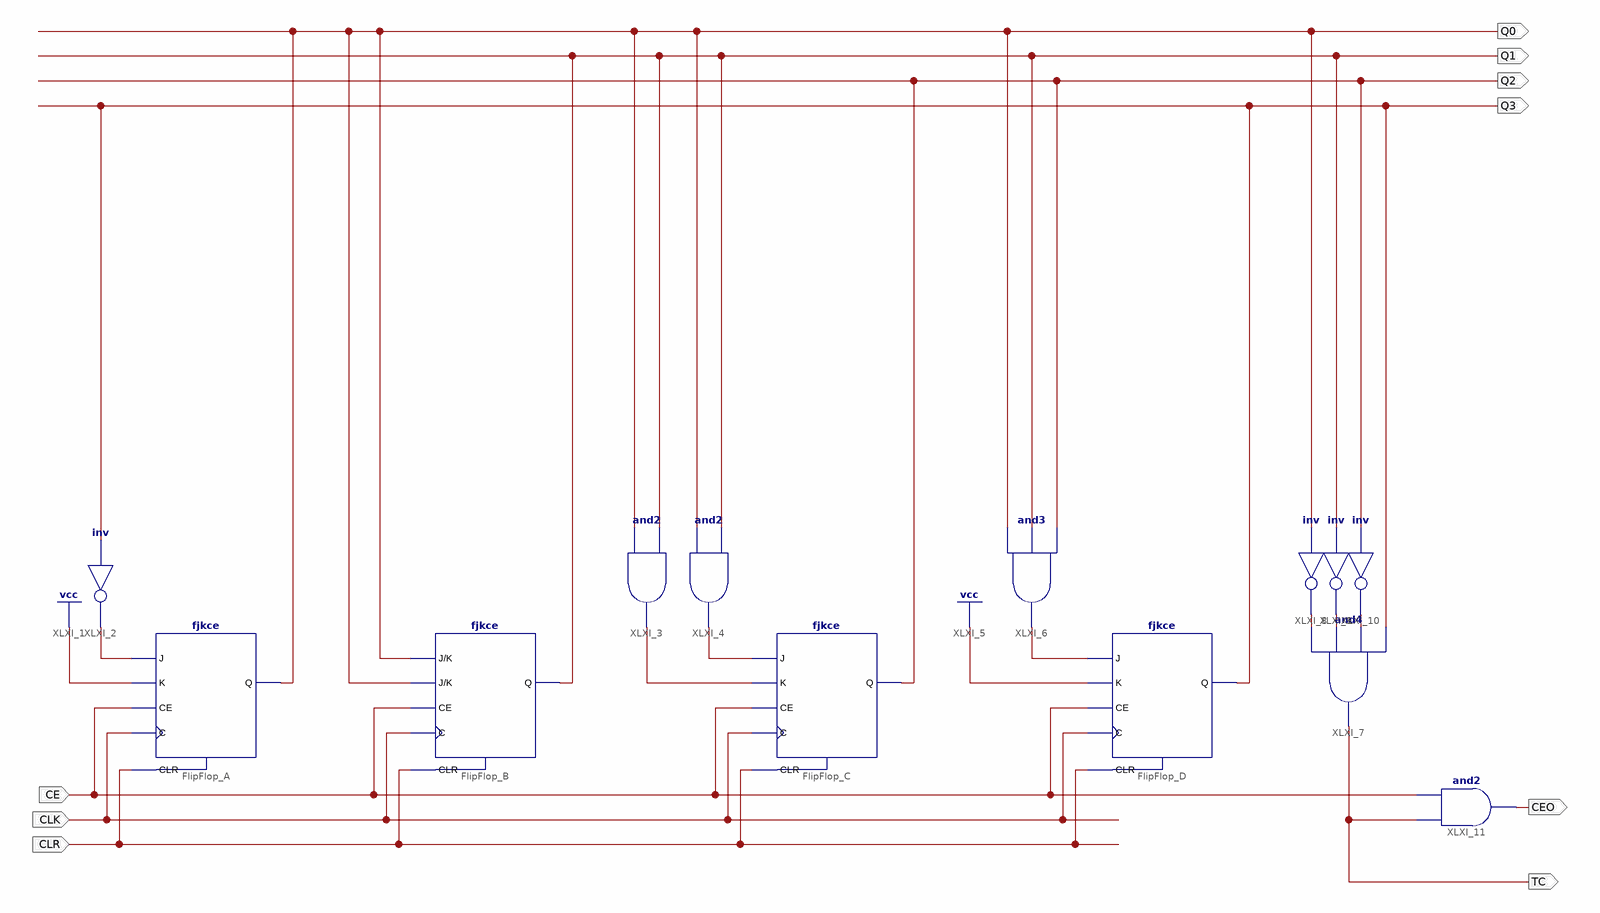
[diagram p0: schematic sheet 1]
// Xilinx ISE schematic counter0_8.sch (spartan6) as structural Verilog: 13 symbols, 9 ports
module counter0_8 (
  input  CE,
  input  CLK,
  input  CLR,
  output CEO,
  output TC,
  output Q0,
  output Q1,
  output Q2,
  output Q3
);

  wire XLXN_2, XLXN_3, XLXN_4, XLXN_6, XLXN_7, XLXN_8, XLXN_9;

  not XLXI_2 (XLXN_2, Q3);
  fjkce FlipFlop_A (.C(CLK), .CE(CE), .CLR(CLR), .J(XLXN_2), .K(1'b1), .Q(Q0));
  fjkce FlipFlop_B (.C(CLK), .CE(CE), .CLR(CLR), .J(Q0), .K(Q0), .Q(Q1));
  and XLXI_3 (XLXN_3, Q0, Q1);
  and XLXI_4 (XLXN_4, Q0, Q1);
  fjkce FlipFlop_C (.C(CLK), .CE(CE), .CLR(CLR), .J(XLXN_4), .K(XLXN_3), .Q(Q2));
  and XLXI_6 (XLXN_6, Q0, Q1, Q2);
  fjkce FlipFlop_D (.C(CLK), .CE(CE), .CLR(CLR), .J(XLXN_6), .K(1'b1), .Q(Q3));
  and XLXI_7 (TC, XLXN_7, XLXN_8, XLXN_9, Q3);
  not XLXI_8 (XLXN_7, Q0);
  not XLXI_9 (XLXN_8, Q1);
  not XLXI_10 (XLXN_9, Q2);
  and XLXI_11 (CEO, CE, TC);
endmodule
